# EAGLE schematic Autopilot_remote_receiver (EAGLE 8.0.1)
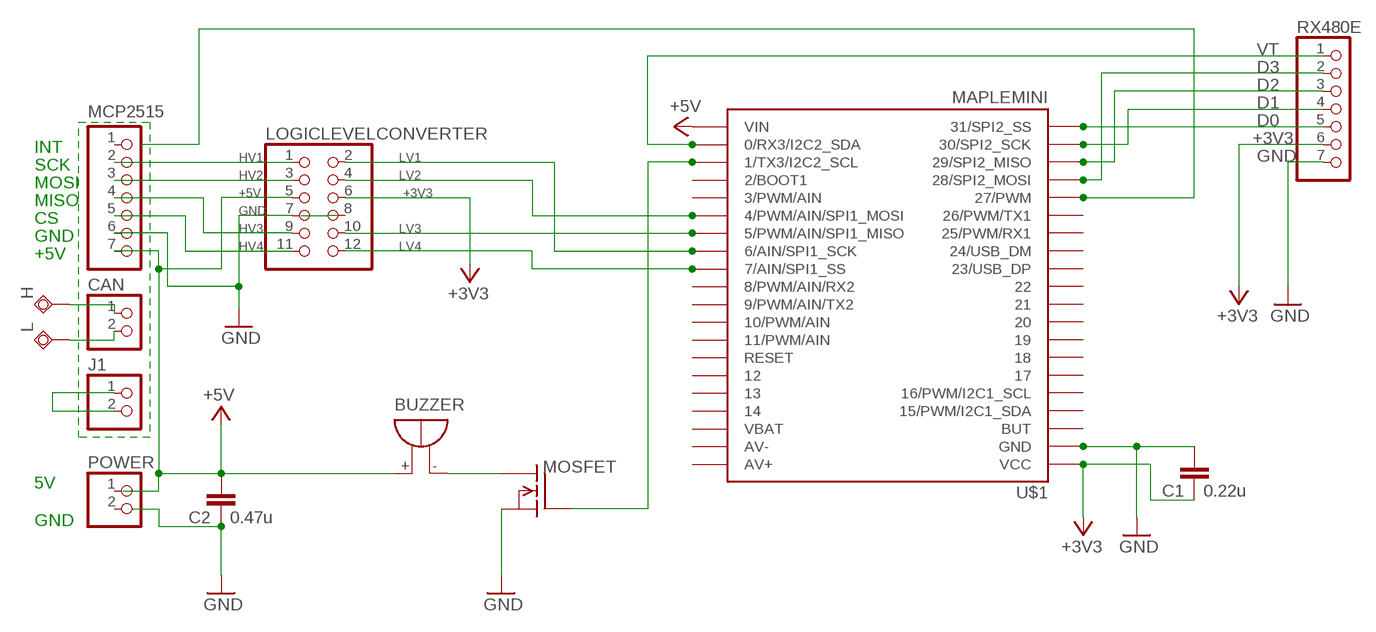
[diagram p0: schematic, sheet 1]

## Parts
BUZZER  F/BC35  [F/BC35]
C1  0.22u  C-EU050-025X075  [C050-025X075]
C2  0.47u  C-EU050-025X075  [C050-025X075]
CAN  PINHD-1X2  [1X02]
H  TPSQPAD1-20  [P1-20]
J1  PINHD-1X2  [1X02]
L  TPSQPAD1-20  [P1-20]
LOGICLEVELCONVERTER  PINHD-2X6  [2X06]
MCP2515  PINHD-1X7  [1X07]
MOSFET  BUZ11  [TO220]
POWER  PINHD-1X2  [1X02]
RX480E  PINHD-1X7  [1X07]
U$1  MAPLEMINI  [20-DIP]

## Nets
+3V3: C1.1 LOGICLEVELCONVERTER.6 RX480E.6 U$1.1(VCC)
+5V: BUZZER.+ C2.2 LOGICLEVELCONVERTER.5 MCP2515.7 U$1.21(VIN)
D0: RX480E.5 U$1.20(31/SPI2_SS)
D1: RX480E.4 U$1.19(30/SPI2_SCK)
D2: RX480E.3 U$1.18(29/SPI2_MISO)
D3: RX480E.2 U$1.17(28/SPI2_MOSI)
GND: C1.2 C2.1 LOGICLEVELCONVERTER.7 MCP2515.6 MOSFET.3(S) RX480E.7 U$1.2(GND)
HV1: LOGICLEVELCONVERTER.1 MCP2515.2
HV2: LOGICLEVELCONVERTER.3 MCP2515.3
HV3: LOGICLEVELCONVERTER.9 MCP2515.4
HV4: LOGICLEVELCONVERTER.11 MCP2515.5
LV1: LOGICLEVELCONVERTER.2 U$1.28(6/AIN/SPI1_SCK)
LV2: LOGICLEVELCONVERTER.4 U$1.26(4/PWM/AIN/SPI1_MOSI)
LV3: LOGICLEVELCONVERTER.10 U$1.27(5/PWM/AIN/SPI1_MISO)
LV4: LOGICLEVELCONVERTER.12 U$1.29(7/AIN/SPI1_SS)
N$2: CAN.1 H.TP
N$3: CAN.2 L.TP
N$4: J1.1 J1.2
N$6: BUZZER.- MOSFET.2(D)
N$9: U$1.16(27/PWM)
N$12: MOSFET.1(G) U$1.23(1/TX3/I2C2_SCL)
VT: RX480E.1 U$1.22(0/RX3/I2C2_SDA)
Unconnected: LOGICLEVELCONVERTER.8 MCP2515.1 POWER.1 POWER.2 U$1.3(BUT) U$1.4(15/PWM/I2C1_SDA) U$1.5(16/PWM/I2C1_SCL) U$1.6 U$1.7 U$1.8 U$1.9 U$1.10 U$1.11 U$1.12(23/USB_DP) U$1.13(24/USB_DM) U$1.14(25/PWM/RX1) U$1.15(26/PWM/TX1) U$1.24(2/BOOT1) U$1.25(3/PWM/AIN) U$1.30(8/PWM/AIN/RX2) U$1.31(9/PWM/AIN/TX2) U$1.32(10/PWM/AIN) U$1.33(11/PWM/AIN) U$1.34(RESET) U$1.35 U$1.36 U$1.37 U$1.38(VBAT) U$1.39(AV-) U$1.40(AV+)

## Notes on the sheet
- INT
- SCK
- MOSI
- MISO
- CS
- GND
- +5V
- 5V
  
  GND

## Library data of the parts
BUZZER = buzzer:F/BC35: BUZZER Source: Spoerle; OC_FARNELL: unknown; OC_NEWARK: unknown
C1 C2 = rcl:C-EU: CAPACITOR, European symbol; SPICEPREFIX: C
CAN J1 POWER = pinhead:PINHD-1X2: PIN HEADER
H L = testpad:TPSQ: Test pad
LOGICLEVELCONVERTER = pinhead:PINHD-2X6: PIN HEADER
MCP2515 RX480E = pinhead:PINHD-1X7: PIN HEADER
MOSFET = transistor-fet:BUZ11: N-Channel Enhancement MOSFET 50V; 30A; 0,040Ohm
U$1 = maplemini:MAPLEMINI